# Altium schematic sheet Si4010 Beacon Adjusted.SchDoc: VHF Beacon
size A4; Revision: AA; SheetNumber: 5; SheetTotal: 6
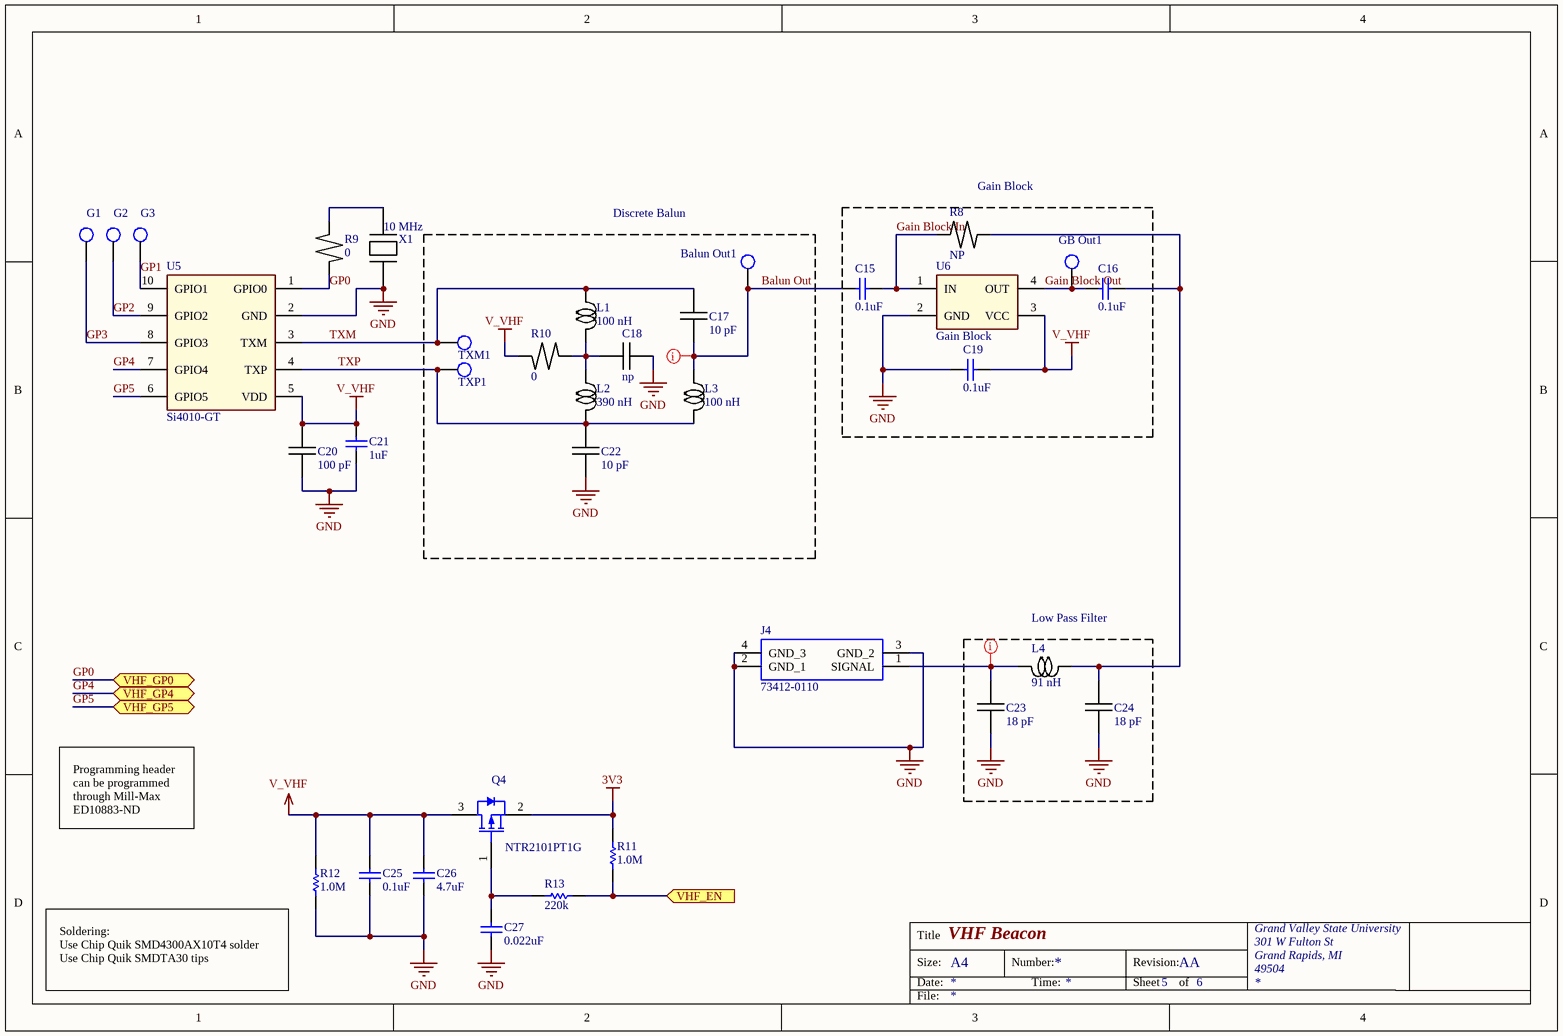
[diagram p0: Si4010 Beacon Adjusted.SchDoc]

## Parts
Balun_Out1  Test Point  [Test Point-SM35]  (value not drawn)  (no BOM)
C15  value 0.1uF  [0402cap]  (hidden comment: C0402)
C16  value 0.1uF  [0402cap]  (hidden comment: C0402)
C17  value 10 pF  [Capacitor - 0402]  (hidden comment: Chip Capacitor)
C18  value np  [Capacitor - 0402]  (hidden comment: Chip Capacitor)
C19  value 0.1uF  [0402cap]  (hidden comment: C0402)
C20  value 100 pF  [Capacitor - 0402]  (hidden comment: Chip Capacitor)
C21  value 1uF  [0402cap]  (hidden comment: C0402)
C22  value 10 pF  [Capacitor - 0402]  (hidden comment: Chip Capacitor)
C23  value 18 pF  [Capacitor - 0402]  (hidden comment: Chip Capacitor)
C24  value 18 pF  [Capacitor - 0402]  (hidden comment: Chip Capacitor)
C25  value 0.1uF  [0402cap]  (hidden comment: C0402)
C26  value 4.7uF  [0603CAP]  (hidden comment: C0603)
C27  value 0.022uF  [0402cap]  (hidden comment: C0402)
G1  Test Point  [Test Point-SM55]  (value not drawn)  (no BOM)
G2  Test Point  [Test Point-SM55]  (value not drawn)  (no BOM)
G3  Test Point  [Test Point-SM55]  (value not drawn)  (no BOM)
GB_Out1  Test Point  [Test Point-SM35]  (value not drawn)  (no BOM)
J4  73412-0110  [73412-0110]
L1  value 100 nH  [Inductor - 0402]  (hidden comment: 0402)
L2  value 390 nH  [Inductor - 0402]  (hidden comment: 0402)
L3  value 100 nH  [Inductor - 0402]  (hidden comment: 0402)
L4  value 91 nH  [Inductor - 0402]  (hidden comment: 0402)
Q4  NTR2101PT1G  [ONSC-SOT-23-3-318-08_V]
R8  value NP  [Resistor - 0402]  (hidden comment: Chip Resistor)
R9  value 0  [Resistor - 0402]  (hidden comment: Chip Resistor)
R10  value 0  [Resistor - 0402]  (hidden comment: Chip Resistor)
R11  value 1.0M  [0402RES]  (hidden comment: R0402)
R12  value 1.0M  [0402RES]  (hidden comment: R0402)
R13  value 220k  [0402RES]  (hidden comment: R0402)
TXM1  Test Point  [Test Point-SM35]  (value not drawn)  (no BOM)
TXP1  Test Point  [Test Point-SM35]  (value not drawn)  (no BOM)
U5  Si4010-GT  [MSOP10]
U6  Gain Block  [BGA427]
X1  value 10 MHz  [ECS Crystal]  (hidden comment: Crystal)

## Blocks framed on the sheet
Discrete Balun: Balun_Out1 C17 C18 C22 L1-L3 R10 TXM1 TXP1
Gain Block: C15 C16 C19 GB_Out1 R8 U6
Low Pass Filter: C23 C24 L4

## Ports
VHF_EN (in), VHF_GP0 (bidir), VHF_GP4 (bidir), VHF_GP5 (bidir)

## Nets
3V3: Q4.2(S) R11.2
GND: C18.1 C19.1 C20.2 C21.1 C22.1 C23.2 C24.2 C25.1 C26.1 C27.1 J4.2(GND_1) J4.3(GND_2) J4.4(GND_3) R12.1 U5.2(GND) U6.2(GND) X1.1
V_VHF: C19.2 C20.1 C21.2 C25.2 C26.2 Q4.3(D) R10.1 R12.2 U5.5(VDD) U6.3(VCC)
Balun Out: Balun_Out1.1 C15.1 C17.1 L3.1
Gain Block In: C15.2 R8.1 U6.1(IN)
Gain Block Out: C16.1 GB_Out1.1 U6.4(OUT)
GP0: R9.2 U5.1(GPIO0) ; port VHF_GP0
GP1: G3.1 U5.10(GPIO1)
GP2: G2.1 U5.9(GPIO2)
GP3: G1.1 U5.8(GPIO3)
GP4: U5.7(GPIO4) ; port VHF_GP4
GP5: U5.6(GPIO5) ; port VHF_GP5
TXM: C17.2 L1.1 TXM1.1 U5.3(TXM)
TXP: C22.2 L2.2 L3.2 TXP1.1 U5.4(TXP)
VHF_EN: R11.1 R13.1 ; port VHF_EN
NetC16_2: C16.2 C24.1 L4.2 R8.2
NetC18_2: C18.2 L1.2 L2.1 R10.2
NetC23_1: C23.1 J4.1(SIGNAL) L4.1
NetC27_2: C27.2 Q4.1(G) R13.2
NetR9_1: R9.1 X1.3

## Layout directives
net class 50_OHM: Balun Out, NetC23_1

## Notes on the sheet
- Programming header can be programmed through Mill-Max ED10883-ND
- (near R12) Soldering:
  Use Chip Quik SMD4300AX10T4 solder
  Use Chip Quik SMDTA30 tips
- Title
- Size:
- Date:
- A4
- Number:
- Time:
- Revision:
- Sheet
- of
- Grand Valley State University
- 301 W Fulton St
- Grand Rapids, MI
- 49504
- File:

## Library data of the parts
C15 C16 C19 = C0402: 0402 Ceramic Chip Capacitor - Standard; Manufacturer 1: Samsung; Manufacturer Part Number 1: CL05B104KO5NNNC; Supplier 1: Digi-Key; Supplier Part Number 1: 1276-1001-1-ND
C17 = Chip Capacitor: Manufacturer 1: Murata; Manufacturer Part Number 1: GCM1555C1H100FA16D; Vendor: *; Vendor PN: *; Price: 0.14
C20 = Chip Capacitor: Manufacturer 1: Murata Electronics North America; Manufacturer Part Number 1: GRM1555C1H101JA01J; Supplier 1: Digi-Key; Supplier Part Number 1: 490-7754-1-ND; Price: 0.1
C21 C25 = C0402: 0402 Ceramic Chip Capacitor - Standard
C23 C24 = Chip Capacitor: Manufacturer 1: Kemet; Manufacturer Part Number 1: CBR04C180F5GAC; Vendor: *; Vendor PN: *; Price: 0.32
C26 = C0603: 0603 Ceramic Chip Capacitor - Standard
C27 = C0402: 0402 Ceramic Chip Capacitor - Standard; Manufacturer 1: Taiyo Yuden; Manufacturer Part Number 1: EMK105B7223KV-F; Supplier 1: Digi-Key; Supplier Part Number 1: 587-1224-1-ND
J4 = 73412-0110: 50 Ohms, MCRF, PCB Vertical Jack Receptacle, SMT, 1.25mm Mounted Height; Manufacturer_Name: Molex; Allied_Number: 70357960; Manufacturer_Part_Number: 73412-0110; RS Part Number: 1676350; RS Price/Stock: http://uk.rs-online.com/web/p/products/1676350; Allied Price/Stock: https://www.alliedelec.com/molex-incorporated-73412-0110/70357960/; Mouser Part Number: 538-73412-0110; Mouser Price/Stock: https://www.mouser.com/Search/Refine.aspx?Keyword=538-73412-0110; Datasheet Link: http://www.molex.com/pdm_docs/sd/734120110_sd.pdf
L1 L3 = Inductor - 0402: 0402 Inductor; Manufacturer 1: TDK; Manufacturer Part Number 1: MLG1005SR10JT000; Vendor: *; Vendor PN: *; Price: 0.1
L2 = Inductor - 0402: 0402 Inductor; Manufacturer 1: TDK; Manufacturer Part Number 1: MHQ1005PR39HT000; Vendor: Digikey; Vendor PN: 445-175487-1-ND; Price: 0.28
L4 = Inductor - 0402: 0402 Inductor; Manufacturer 1: TDK; Manufacturer Part Number 1: MLG1005S91NJT000; Vendor: *; Vendor PN: *; Price: 0.1
Q4 = NTR2101PT1G: Small Signal MOSFET, -8 V, -3.7 A, Single P-Channel, 3-Pin SOT-23, Pb-Free, Tape and Reel; Manufacturer 1: On Semiconductor; Channel Polarity: P Channel; Ciss Typ (pF): 1173; Coss Typ (pF): 289; Crss Typ (pF): 218; ID Max (A): 3.7; PD Max (W): 0.96; V(BR)DSS Min (V): 8; VGS(th) Max (V): 1; DatasheetVersion: Rev. 6; PackageVersion: Rev. AP, 11/2009; PackageReference: SOT-23-3-318-08; PackageDescription: 3-Pin Small Outline Transistor, Body 2.92 x 1.3 mm, Pitch 0.95 mm; Configuration: Single; Package Type: SOT-23-3; Packing: Tape and Reel; RoHS: Pb-Free; VGS Max (V): 8; Mounting Technology: Surface Mount; Manufacturer Part Number 1: NTR2101PT1G; ComponentLink1Description: Manufacturer URL; ComponentLink1URL: http://www.onsemi.com/; ComponentLink2Description: Datasheet; ComponentLink2URL: http://www.onsemi.cn/pub_link/Collateral/NTR2101P-D.PDF; ComponentLink3Description: Package Specification; ComponentLink3URL: http://www.onsemi.cn/pub_link/Collateral/318-08.PDF
R9 R10 = Chip Resistor: Manufacturer 1: Yageo; Manufacturer Part Number 1: RC0402JR-070RL; Vendor: *; Vendor PN: *; Price: 0.1
R11-R13 = R0402: 0402 Chip Resistor - Standard; ComponentLink1URL: *
U5 = Si4010-GT: Transmitter/MCU; Manufacturer: Silion Labs; Manufacturer PN: Si4010-C2-GT; Vendor: Digi-Key; Vendor PN: 336-4342-1-ND; Price: 3.75; Value: -
U6 = BGA427: Manufacturer: Infineon; Manufacturer PN: BGA427H6327XTSA1; Value: *; Price: 0.84; Vendor: *; Vendor PN: *
X1 = ECS 53B Crystal: Manufacturer: ECS; Manufacturer PN: ECS-100-10-30B-CKL-TR; Vendor: *; Vendor PN: *; Price: 0.69
Balun_Out1 G1-G3 GB_Out1 TXM1 TXP1 = Test Point: Manufacturer: *; Manufacturer PN: *; Vendor: *; Vendor PN: *; Price: *
C18 C22 = Chip Capacitor: Vendor: *; Vendor PN: *
  C18: Manufacturer: *; Manufacturer PN: *; Price: *
  C22: Manufacturer 1: *; Manufacturer Part Number 1: *; Price: 0.14
R8 = Chip Resistor: Vendor: *; Vendor PN: *; Manufacturer: *; Manufacturer PN: *; Price: *